# Altium schematic sheet Communication.SchDoc
size A; SheetNumber: 4
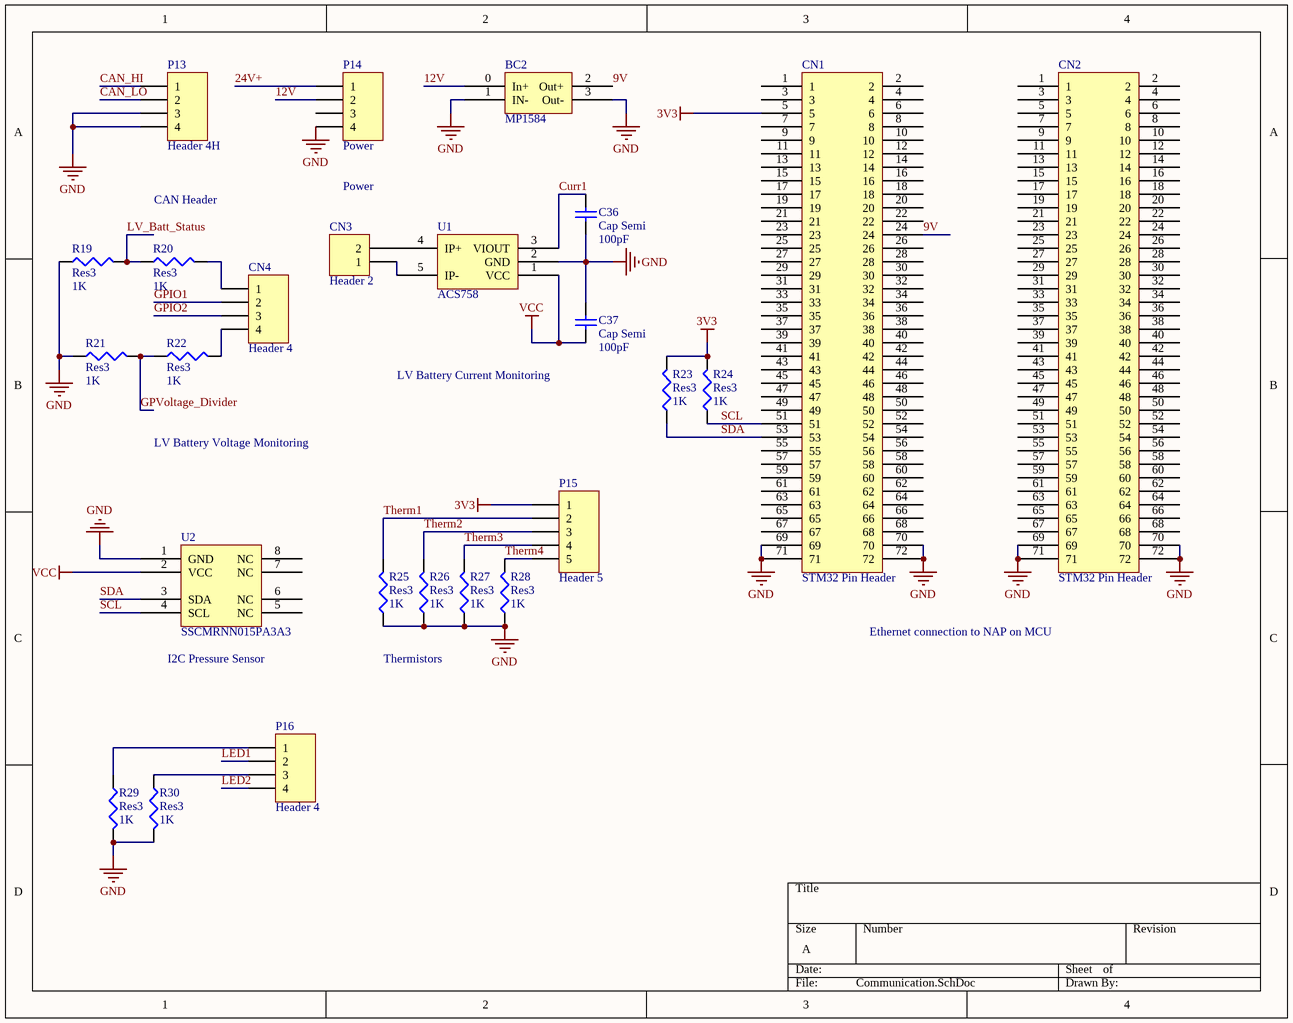
[diagram p0: Communication.SchDoc]

## Parts
BC2  MP1584
C36  Cap Semi  value 100pF  [C1206]
C37  Cap Semi  value 100pF  [C1206]
CN1  STM32 Pin Header
CN2  STM32 Pin Header
CN3  Header 2  [HDR1X2]
CN4  Header 4  [HDR1X4]
P13  Header 4H  [HDR1X4H]
P14  Power  [HDR1X4]
P15  Header 5  [HDR1X5]
P16  Header 4  [HDR1X4]
R19  Res3  value 1K  [J1-0603]
R20  Res3  value 1K  [J1-0603]
R21  Res3  value 1K  [J1-0603]
R22  Res3  value 1K  [J1-0603]
R23  Res3  value 1K  [J1-0603]
R24  Res3  value 1K  [J1-0603]
R25  Res3  value 1K  [J1-0603]
R26  Res3  value 1K  [J1-0603]
R27  Res3  value 1K  [J1-0603]
R28  Res3  value 1K  [J1-0603]
R29  Res3  value 1K  [J1-0603]
R30  Res3  value 1K  [J1-0603]
U1  ACS758  [ACS758]
U2  SSCMRNN015PA3A3  [Honeywell SMD]

## Nets
3V3: CN1.5 P15.1 R23.2 R24.2
GND: BC2.1(IN-) BC2.3(Out-) C36.1 C37.2 CN1.69 CN1.70 CN1.71 CN1.72 CN2.69 CN2.70 CN2.71 CN2.72 P13.3 P13.4 P14.4 R19.1 R21.1 R25.1 R26.1 R27.1 R28.1 R29.2 R30.2 U1.2(GND) U2.1(GND)
VCC: C37.1 U1.1(VCC) U2.2(VCC)
9V: BC2.2(Out+) CN1.24
12V: BC2.0(In+) P14.2
24V+: P14.1
CAN_HI: P13.1
CAN_LO: P13.2
Curr1: C36.2 U1.3(VIOUT)
GPIO1: CN4.2
GPIO2: CN4.3
GPVoltage_Divider: R21.2 R22.1
LED1: P16.2
LED2: P16.4
LV_Batt_Status: R19.2 R20.1
SCL: CN1.51 R24.1 U2.4(SCL)
SDA: CN1.53 R23.1 U2.3(SDA)
Therm1: P15.2 R25.2
Therm2: P15.3 R26.2
Therm3: P15.4 R27.2
Therm4: P15.5 R28.2
NetCN3_1: CN3.1 U1.5(IP-)
NetCN3_2: CN3.2 U1.4(IP+)
NetCN4_1: CN4.1 R20.2
NetCN4_4: CN4.4 R22.2
NetP16_1: P16.1 R29.1
NetP16_3: P16.3 R30.1

Not connected (* = marked no-connect by the designer): CN1 1 2 3 4 6 7 8 9 10 11 12 13 14 15 16 17 18 19 20 21 22 23 25 26 27 28 29 30 31 32 33 34 35 36 37 38 39 40 41 42 43 44 45 46 47 48 49 50 52 54 55 56 57 58 59 60 61 62 63 64 65 66 67 68; CN2 1 2 3 4 5 6 7 8 9 10 11 12 13 14 15 16 17 18 19 20 21 22 23 24 25 26 27 28 29 30 31 32 33 34 35 36 37 38 39 40 41 42 43 44 45 46 47 48 49 50 51 52 53 54 55 56 57 58 59 60 61 62 63 64 65 66 67 68; P14 3; U2 5(NC) 6(NC) 7(NC) 8(NC)

## Notes on the sheet
- CAN Header
- Power
- (near C37) LV Battery Current Monitoring
- LV Battery Voltage Monitoring
- Ethernet connection to NAP on MCU
- (near U2) I2C Pressure Sensor
- Thermistors

## Library data of the parts
C36 C37 = Cap Semi: Capacitor (Semiconductor SIM Model); Published: 8-Jun-2000; LatestRevisionDate: 29-May-2009; LatestRevisionNote: IPC-7351 Footprint Added.; PackageReference: C1206; Publisher: Altium Limited; PackageDescription: Chip Capacitor
CN3 = Header 2: Header, 2-Pin; LatestRevisionDate: 17-Jul-2002; LatestRevisionNote: Re-released for DXP Platform.; Publisher: Altium Limited
CN4 P14 P16 = Header 4: Header, 4-Pin; LatestRevisionDate: 17-Jul-2002; LatestRevisionNote: Re-released for DXP Platform.; Publisher: Altium Limited
P13 = Header 4H: Header, 4-Pin, Right Angle; LatestRevisionDate: 17-Jul-2002; LatestRevisionNote: Re-released for DXP Platform.; Publisher: Altium Limited
P15 = Header 5: Header, 5-Pin; LatestRevisionDate: 17-Jul-2002; LatestRevisionNote: Re-released for DXP Platform.; Publisher: Altium Limited
R19-R30 = Res3: Resistor; Published: 8-Jun-2000; LatestRevisionDate: 29-May-2009; LatestRevisionNote: IPC-7351 Footprint Added.; PackageReference: J1-0603; Publisher: Altium Limited; PackageDescription: Chip Resistor
U1 = CurrSens
U2 = AmbPressTemp